# Altium project 6502_VGA.PrjPcb
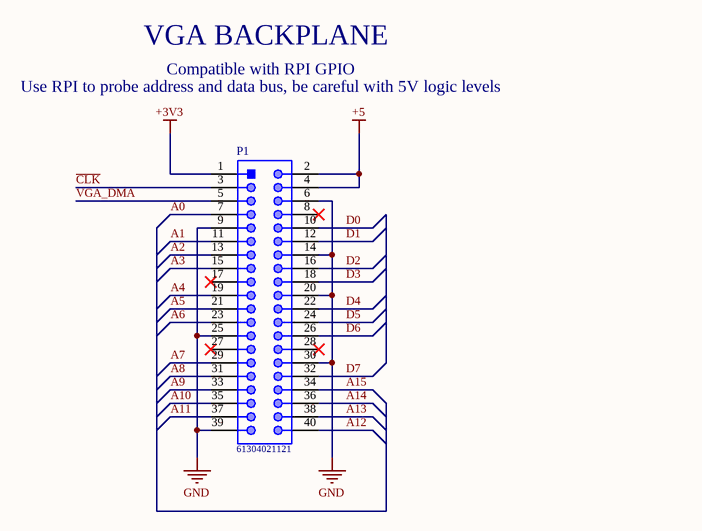
[diagram p0: 6502_connection.SchDoc]
3 sheets, 20 parts. Net scope: global (net labels, ports and power ports of the same name join across sheets).
Board file: 6502_VGA.PcbDoc
Sheets:
  6502_connection.SchDoc
  horizontal_counter.SchDoc
  vertical_counter.SchDoc

## Sheet 6502_connection.SchDoc
size A4; SheetNumber: 1; SheetTotal: 4

### Parts
P1  61304021121  [61304021121]

### Nets
+3V3: P1.1
+5: P1.2 P1.4
GND: P1.6 P1.9 P1.14 P1.20 P1.25 P1.30 P1.39
A0: P1.7
A1: P1.11
A2: P1.13
A3: P1.15
A4: P1.19
A5: P1.21
A6: P1.23
A7: P1.29
A8: P1.31
A9: P1.33
A10: P1.35
A11: P1.37
A12: P1.40
A13: P1.38
A14: P1.36
A15: P1.34
~{CLK}: P1.3
D0: P1.10
D1: P1.12
D2: P1.16
D3: P1.18
D4: P1.22
D5: P1.24
D6: P1.26
D7: P1.32
VGA_~{DMA}: P1.5

Not connected (* = marked no-connect by the designer): P1 8* 17* 27* 28*

### Notes on the sheet
- VGA BACKPLANE
- Compatible with RPI GPIO
- Use RPI to probe address and data bus, be careful with 5V logic levels

### Library data of the parts
P1 = CMP-1502-01135-1: THT Vertical Pin Header WR-PHD, Pitch 2.54 mm, Dual Row, 40 pins; Manufacturer: Wurth Elektronik; Contact Resistance: 20mOhm; Pitch: 2.54mm; Pin Number: 40; Withstanding Voltage: 500VAC; Gender: Male; Rated Current: 3A; Working Voltage: 250VAC; Operating Temperature: -40to105degC; Manufacturer URL: http://www.we-online.de; Orientation: Vertical; Datasheet URL: https://katalog.we-online.de/em/datasheet/6130xx21121.pdf; Package Reference: 61304021121; Row Number: Dual; Part Number: 61304021121; Packaging: Bag; Mounting Technology: THT; Publisher: WurthElektronik

## Sheet horizontal_counter.SchDoc
size A4; SheetNumber: 2; SheetTotal: 4
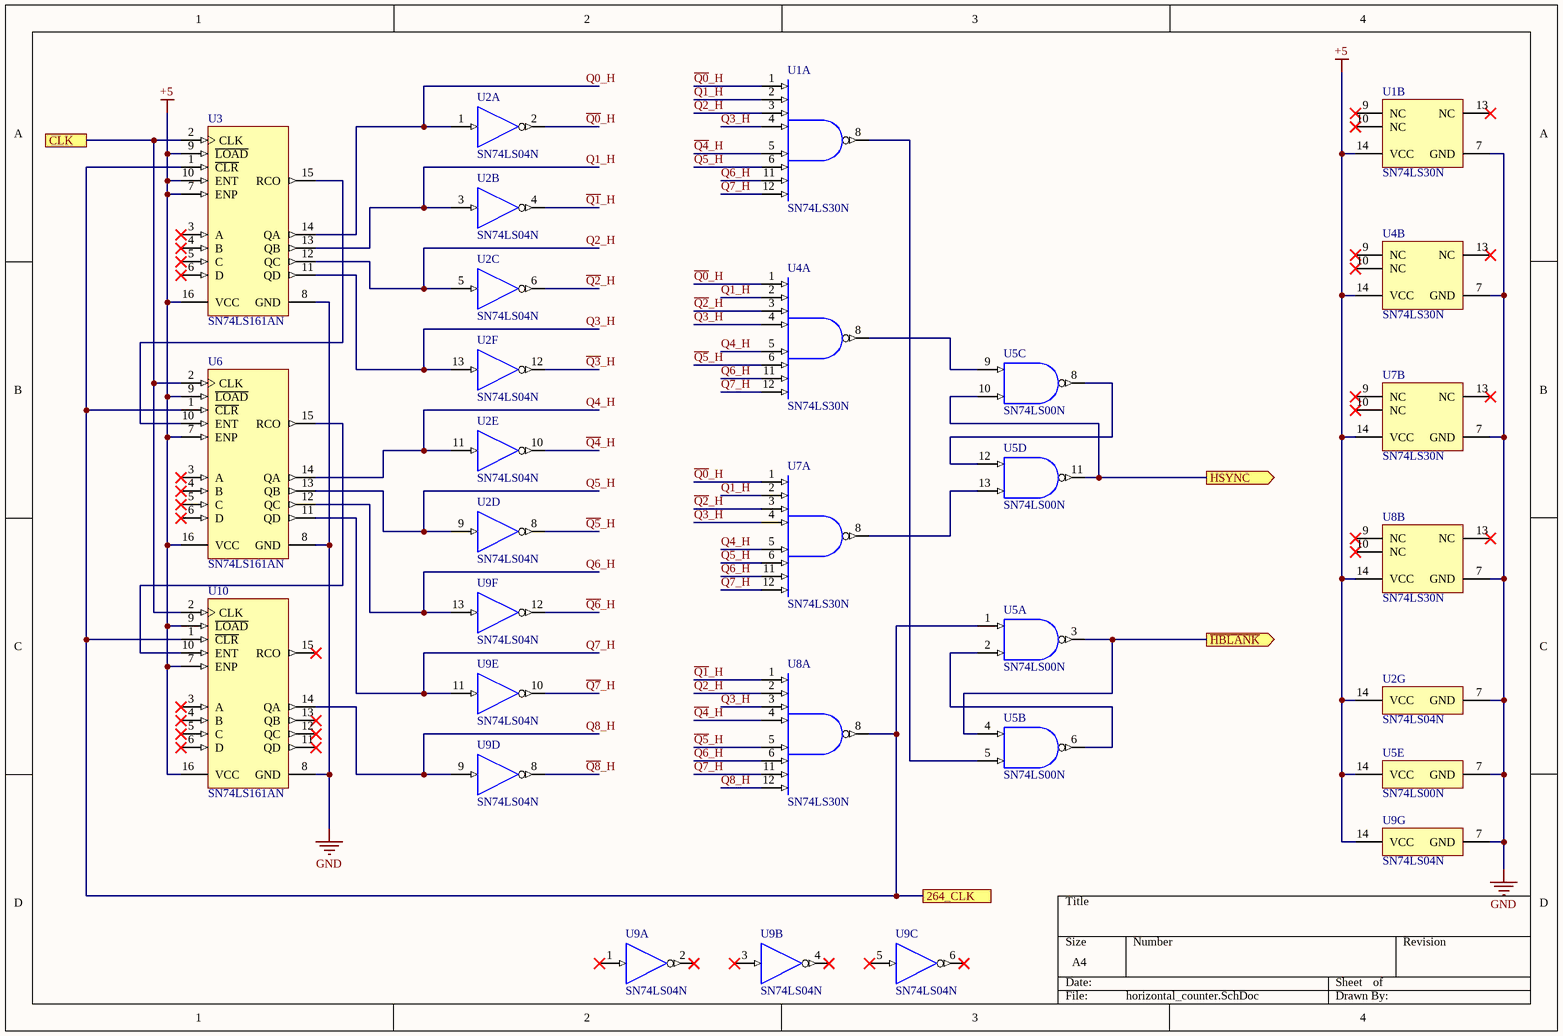
[diagram p1: horizontal_counter.SchDoc]

### Parts
U1  SN74LS30N  [N0014A]  (parts A,B of 2)
U2  SN74LS04N  [N0014A]  (parts A,B,C,D,E,F,G of 7)
U3  SN74LS161AN  [N0016A]
U4  SN74LS30N  [N0014A]  (parts A,B of 2)
U5  SN74LS00N  [N0014A]  (parts A,B,C,D,E of 5)
U6  SN74LS161AN  [N0016A]
U7  SN74LS30N  [N0014A]  (parts A,B of 2)
U8  SN74LS30N  [N0014A]  (parts A,B of 2)
U9  SN74LS04N  [N0014A]  (parts A,B,C,D,E,F,G of 7)
U10  SN74LS161AN  [N0016A]

### Ports
264_CLK, CLK, HSYNC (out), ~{HBLANK} (out)

### Nets
+5: U1.14(VCC) U2.14(VCC) U3.7(ENP) U3.9(~{LOAD}) U3.10(ENT) U3.16(VCC) U4.14(VCC) U5.14(VCC) U6.7(ENP) U6.9(~{LOAD}) U6.16(VCC) U7.14(VCC) U8.14(VCC) U9.14(VCC) U10.7(ENP) U10.9(~{LOAD}) U10.16(VCC)
GND: U1.7(GND) U2.7(GND) U3.8(GND) U4.7(GND) U5.7(GND) U6.8(GND) U7.7(GND) U8.7(GND) U9.7(GND) U10.8(GND)
Q0_H: U2.1(1A) U3.14(QA)
Q1_H: U2.3(2A) U3.13(QB) U4.2(B) U7.2(B)
Q2_H: U2.5(3A) U3.12(QC)
Q3_H: U1.4(D) U2.13(6A) U3.11(QD) U8.3(C)
Q4_H: U2.11(5A) U4.5(E) U6.14(QA) U7.5(E)
Q5_H: U2.9(4A) U6.13(QB) U7.6(F)
Q6_H: U1.11(G) U4.11(G) U6.12(QC) U7.11(G) U9.13(6A)
Q7_H: U1.12(H) U4.12(H) U6.11(QD) U7.12(H) U9.11(5A)
Q8_H: U8.12(H) U9.9(4A) U10.14(QA)
~{Q0}_H: U1.1(A) U2.2(~{1Y}) U4.1(A) U7.1(A)
~{Q1}_H: U1.2(B) U2.4(~{2Y}) U8.1(A)
~{Q2}_H: U1.3(C) U2.6(~{3Y}) U4.3(C) U7.3(C) U8.2(B)
~{Q3}_H: U2.12(~{6Y}) U4.4(D) U7.4(D)
~{Q4}_H: U1.5(E) U2.10(~{5Y}) U8.4(D)
~{Q5}_H: U1.6(F) U2.8(~{4Y}) U4.6(F) U8.5(E)
~{Q6}_H: U8.6(F) U9.12(~{6Y})
~{Q7}_H: U8.11(G) U9.10(~{5Y})
~{Q8}_H: U9.8(~{4Y})
NetU1_8: U1.8(~{Y}) U5.5(2B)
NetU3_1: U3.1(~{CLR}) U5.1(1A) U6.1(~{CLR}) U8.8(~{Y}) U10.1(~{CLR}) ; port 264_CLK
NetU3_2: U3.2(CLK) U6.2(CLK) U10.2(CLK) ; port CLK
NetU3_15: U3.15(RCO) U6.10(ENT)
NetU4_8: U4.8(~{Y}) U5.9(3A)
NetU5_2: U5.2(1B) U5.6(2Y)
NetU5_3: U5.3(1Y) U5.4(2A) ; port ~{HBLANK}
NetU5_8: U5.8(3Y) U5.12(4A)
NetU5_10: U5.10(3B) U5.11(4Y) ; port HSYNC
NetU5_13: U5.13(4B) U7.8(~{Y})
NetU6_15: U6.15(RCO) U10.10(ENT)

Not connected (* = marked no-connect by the designer): U1 9(NC)* 10(NC)* 13(NC)*; U3 3(A)* 4(B)* 5(C)* 6(D)*; U4 9(NC)* 10(NC)* 13(NC)*; U6 3(A)* 4(B)* 5(C)* 6(D)*; U7 9(NC)* 10(NC)* 13(NC)*; U8 9(NC)* 10(NC)* 13(NC)*; U9 1(1A)* 2(~{1Y})* 3(2A)* 4(~{2Y})* 5(3A)* 6(~{3Y})*; U10 3(A)* 4(B)* 5(C)* 6(D)* 11(QD)* 12(QC)* 13(QB)* 15(RCO)*

### Library data of the parts
U1 U4 U7 U8 = CMP-1627-00459-2: 8-input positive-NAND gates, N0014A, TUBE; Manufacturer: Texas Instruments; ICC @ Nom Voltage(Max)(mA): 0.006; Rating: Catalog; VCC(Min)(V): 4.75; Voltage(Nom)(V): 5; Input Type: TTL; F @ Nom Voltage(Max)(Mhz): 35; tpd @ Nom Voltage(Max)(ns): 22; Bits(#): 1; Technology Family: LS; Output Drive (IOL/IOH)(Max)(mA): 0.4/-16; Schmitt Trigger: No; VCC(Max)(V): 5.25; PackageReference: N0014A; Code_JEDEC: MS-001; Generic Part Number: SN74LS30; Output Type: TTL; DatasheetVersion: SDLS099; Operating Temperature Range(C): 0 to 70
U2 U9 = CMP-1615-00911-2: Hex inverters, N0014A, TUBE; Manufacturer: Texas Instruments; Output Drive (IOL/IOH)(Max)(mA): -0.4/8; Schmitt Trigger: No; F @ Nom Voltage(Max)(Mhz): 35; Voltage(Nom)(V): 5; Technology Family: LS; Input Type: TTL; Output Type: CMOS; Bits(#): 6; VCC(Max)(V): 5.25; ICC @ Nom Voltage(Max)(mA): 0.033; Rating: Catalog; VCC(Min)(V): 4.75; tpd @ Nom Voltage(Max)(ns): 22; Operating Temperature Range(C): 0 to 70; DatasheetVersion: SDLS029C; Generic Part Number: SN74LS04; Code_JEDEC: MS-001; PackageReference: N0014A
U3 U6 U10 = CMP-1623-00512-2: Synchronous 4-Bit Binary Counters, N0016A, TUBE; Manufacturer: Texas Instruments; VCC(Max)(V): 5.25; tpd @ Nom Voltage(Max)(ns): 35; Output Type: CMOS; Input Type: TTL; ICC @ Nom Voltage(Max)(mA): 32; VCC(Min)(V): 4.75; Technology Family: LS; Voltage(Nom)(V): 5; Output Drive (IOL/IOH)(Max)(mA): 8/-0.4; Inputs: 1; Schmitt Trigger: No; Rating: Catalog; Bits(#): 4; Type: Binary; Generic Part Number: SN74LS161A; Code_JEDEC: MS-001; F @ Nom Voltage(Max)(Mhz): 35; Function: Counter; PackageReference: N0016A; DatasheetVersion: SDLS060; Operating Temperature Range(C): 0 to 70
U5 = CMP-1627-00476-2: Quad 2-input positive-NAND gates, N0014A, TUBE; Manufacturer: Texas Instruments; VCC(Min)(V): 4.75; F @ Nom Voltage(Max)(Mhz): 35; Voltage(Nom)(V): 5; Rating: Catalog; tpd @ Nom Voltage(Max)(ns): 22; Output Type: TTL; Schmitt Trigger: No; Output Drive (IOL/IOH)(Max)(mA): 0.4/-16; Technology Family: LS; ICC @ Nom Voltage(Max)(mA): 0.022; VCC(Max)(V): 5.25; Bits(#): 4; Code_JEDEC: MS-001; Generic Part Number: SN74LS00; Input Type: TTL; Operating Temperature Range(C): 0 to 70; PackageReference: N0014A; DatasheetVersion: SDLS025B

## Sheet vertical_counter.SchDoc
size A4; SheetNumber: 3; SheetTotal: 4
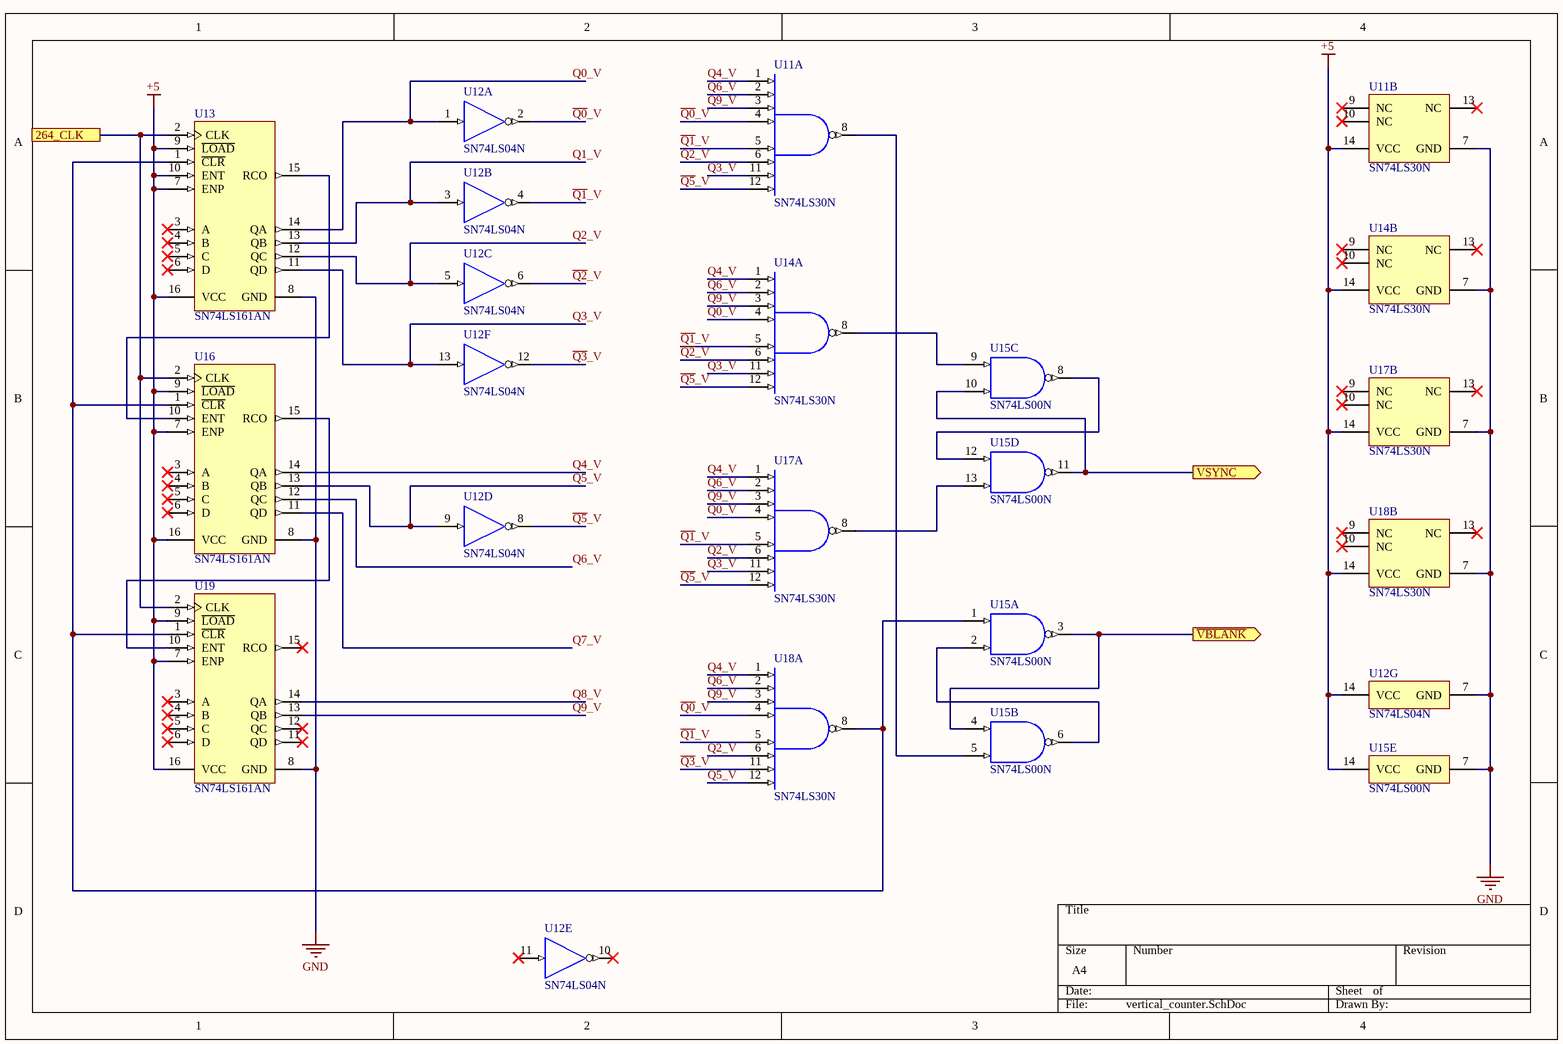
[diagram p2: vertical_counter.SchDoc]

### Parts
U11  SN74LS30N  [N0014A]  (parts A,B of 2)
U12  SN74LS04N  [N0014A]  (parts A,B,C,D,E,F,G of 7)
U13  SN74LS161AN  [N0016A]
U14  SN74LS30N  [N0014A]  (parts A,B of 2)
U15  SN74LS00N  [N0014A]  (parts A,B,C,D,E of 5)
U16  SN74LS161AN  [N0016A]
U17  SN74LS30N  [N0014A]  (parts A,B of 2)
U18  SN74LS30N  [N0014A]  (parts A,B of 2)
U19  SN74LS161AN  [N0016A]

### Ports
264_CLK, VSYNC (out), ~{VBLANK} (out)

### Nets
+5: U11.14(VCC) U12.14(VCC) U13.7(ENP) U13.9(~{LOAD}) U13.10(ENT) U13.16(VCC) U14.14(VCC) U15.14(VCC) U16.7(ENP) U16.9(~{LOAD}) U16.16(VCC) U17.14(VCC) U18.14(VCC) U19.7(ENP) U19.9(~{LOAD}) U19.16(VCC)
GND: U11.7(GND) U12.7(GND) U13.8(GND) U14.7(GND) U15.7(GND) U16.8(GND) U17.7(GND) U18.7(GND) U19.8(GND)
Q0_V: U12.1(1A) U13.14(QA) U14.4(D) U17.4(D)
Q1_V: U12.3(2A) U13.13(QB)
Q2_V: U12.5(3A) U13.12(QC) U17.6(F) U18.6(F)
Q3_V: U11.11(G) U12.13(6A) U13.11(QD) U14.11(G) U17.11(G)
Q4_V: U11.1(A) U14.1(A) U16.14(QA) U17.1(A) U18.1(A)
Q5_V: U12.9(4A) U16.13(QB) U18.12(H)
Q6_V: U11.2(B) U14.2(B) U16.12(QC) U17.2(B) U18.2(B)
Q7_V: U16.11(QD)
Q8_V: U19.14(QA)
Q9_V: U11.3(C) U14.3(C) U17.3(C) U18.3(C) U19.13(QB)
~{Q0}_V: U11.4(D) U12.2(~{1Y}) U18.4(D)
~{Q1}_V: U11.5(E) U12.4(~{2Y}) U14.5(E) U17.5(E) U18.5(E)
~{Q2}_V: U11.6(F) U12.6(~{3Y}) U14.6(F)
~{Q3}_V: U12.12(~{6Y}) U18.11(G)
~{Q5}_V: U11.12(H) U12.8(~{4Y}) U14.12(H) U17.12(H)
NetU3_1: U13.2(CLK) U16.2(CLK) U19.2(CLK) ; port 264_CLK
NetU11_8: U11.8(~{Y}) U15.5(2B)
NetU13_1: U13.1(~{CLR}) U15.1(1A) U16.1(~{CLR}) U18.8(~{Y}) U19.1(~{CLR})
NetU13_15: U13.15(RCO) U16.10(ENT)
NetU14_8: U14.8(~{Y}) U15.9(3A)
NetU15_2: U15.2(1B) U15.6(2Y)
NetU15_3: U15.3(1Y) U15.4(2A) ; port ~{VBLANK}
NetU15_8: U15.8(3Y) U15.12(4A)
NetU15_10: U15.10(3B) U15.11(4Y) ; port VSYNC
NetU15_13: U15.13(4B) U17.8(~{Y})
NetU16_15: U16.15(RCO) U19.10(ENT)

Not connected (* = marked no-connect by the designer): U11 9(NC)* 10(NC)* 13(NC)*; U12 10(~{5Y})* 11(5A)*; U13 3(A)* 4(B)* 5(C)* 6(D)*; U14 9(NC)* 10(NC)* 13(NC)*; U16 3(A)* 4(B)* 5(C)* 6(D)*; U17 9(NC)* 10(NC)* 13(NC)*; U18 9(NC)* 10(NC)* 13(NC)*; U19 3(A)* 4(B)* 5(C)* 6(D)* 11(QD)* 12(QC)* 15(RCO)*

### Library data of the parts
U11 U14 U17 U18 = CMP-1627-00459-2: as U1 on sheet horizontal_counter; PackageReference: N0014A; Code_JEDEC: MS-001; Generic Part Number: SN74LS30; Output Type: TTL; DatasheetVersion: SDLS099; Operating Temperature Range(C): 0 to 70
U12 = CMP-1615-00911-2: as U2 on sheet horizontal_counter; Operating Temperature Range(C): 0 to 70; DatasheetVersion: SDLS029C; Generic Part Number: SN74LS04; Code_JEDEC: MS-001; PackageReference: N0014A
U13 U16 U19 = CMP-1623-00512-2: as U3 on sheet horizontal_counter; Type: Binary; Generic Part Number: SN74LS161A; Code_JEDEC: MS-001; F @ Nom Voltage(Max)(Mhz): 35; Function: Counter; PackageReference: N0016A; DatasheetVersion: SDLS060; Operating Temperature Range(C): 0 to 70
U15 = CMP-1627-00476-2: as U5 on sheet horizontal_counter; Code_JEDEC: MS-001; Generic Part Number: SN74LS00; Input Type: TTL; Operating Temperature Range(C): 0 to 70; PackageReference: N0014A; DatasheetVersion: SDLS025B

## Nets that join several sheets
+5: 6502_connection (P1.2 P1.4), horizontal_counter (17 pins), vertical_counter (16 pins)
GND: 6502_connection (7 pins), horizontal_counter (10 pins), vertical_counter (9 pins)
NetU3_1: horizontal_counter (5 pins), vertical_counter (U13.2 U16.2 U19.2)